# Altium schematic sheet Sheet1.SchDoc
size A
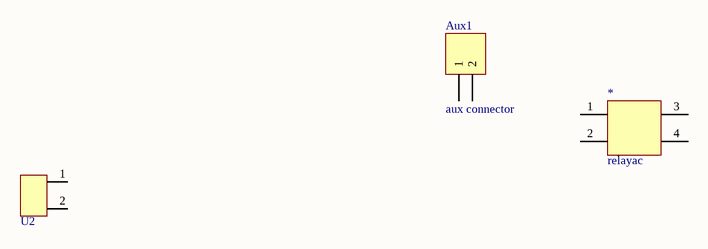
[diagram p0: Sheet1.SchDoc]

## Parts
*  relayac
Aux1  aux connector  [Aux connector]
U2  Connector 60A  [Connector_60A]  (value not drawn)

## Nets

Not connected (* = marked no-connect by the designer): * 1 2 3(2) 4(2); Aux1 1 2; U2 1 2(1)